# Altium schematic sheet PWM_CON_CPU.SchDoc: PWM Motor Controller - CPU
size A4; DocumentNumber: 2; Revision: 2; SheetNumber: 2; SheetTotal: 5; DrawnBy: T. Burns; Organization: N/A; ProjectName: PWM Motor Controller
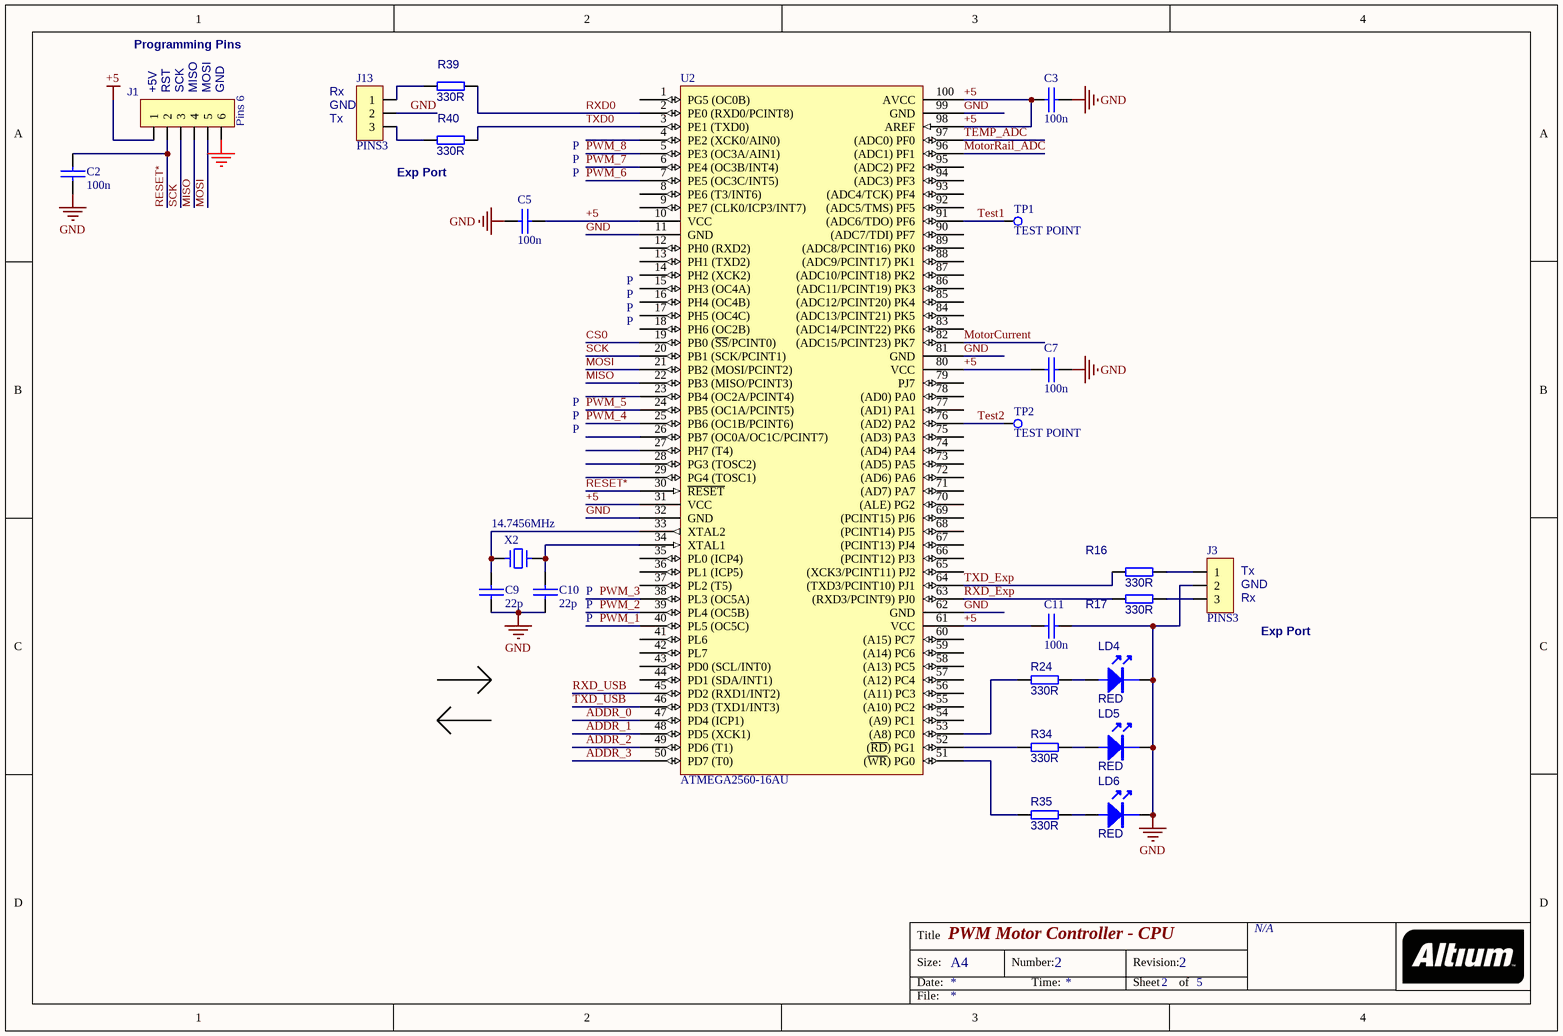
[diagram p0: PWM_CON_CPU.SchDoc]

## Parts
C2  100n  [0603]
C3  100n  [0603]
C5  100n  [0603]
C7  100n  [0603]
C9  22p  [0603]
C10  22p  [0603]
C11  100n  [0603]
J1  Pins 6  [SIP6]
J3  PINS3  [SIP3]
J13  PINS3  [SIP3]
LD4  RED  [0805DIODE]
LD5  RED  [0805DIODE]
LD6  RED  [0805DIODE]
R16  330R  [0603]
R17  330R  [0603]
R24  330R  [0603]
R34  330R  [0603]
R35  330R  [0603]
R39  330R  [0603]
R40  330R  [0603]
TP1  TEST POINT  [TEST POINT]
TP2  TEST POINT  [TEST POINT]
U2  ATMEGA2560-16AU  [100T1_N]
X2  14.7456MHz  [XTAL-V2]

## Nets
+5: C3.2 C5.1 C7.2 C11.2 J1.1 U2.10(VCC) U2.31(VCC) U2.61(VCC) U2.80(VCC) U2.98(AREF) U2.100(AVCC)
GND: C2.1 C3.1 C5.2 C7.1 C9.2 C10.2 C11.1 J1.6 J3.2 J13.2 LD4.K LD5.K LD6.K U2.11(GND) U2.32(GND) U2.62(GND) U2.81(GND) U2.99(GND)
ADDR_0: U2.47(PD4_(ICP1))
ADDR_1: U2.48(PD5_(XCK1))
ADDR_2: U2.49(PD6_(T1))
ADDR_3: U2.50(PD7_(T0))
CS0: U2.19(PB0_(~{SS}/PCINT0))
MISO: J1.4 U2.22(PB3_(MISO/PCINT3))
MOSI: J1.5 U2.21(PB2_(MOSI/PCINT2))
MotorCurrent: U2.82((ADC15/PCINT23)_PK7)
MotorRail_ADC: U2.96((ADC1)_PF1)
PWM_1: U2.40(PL5_(OC5C))
PWM_2: U2.39(PL4_(OC5B))
PWM_3: U2.38(PL3_(OC5A))
PWM_4: U2.25(PB6_(OC1B/PCINT6))
PWM_5: U2.24(PB5_(OC1A/PCINT5))
PWM_6: U2.7(PE5_(OC3C/INT5))
PWM_7: U2.6(PE4_(OC3B/INT4))
PWM_8: U2.5(PE3_(OC3A/AIN1))
RESET*: C2.2 J1.2 U2.30(~{RESET})
RXD0: R39.2 U2.2(PE0_(RXD0/PCINT8))
RXD_Exp: R17.1 U2.63((RXD3/PCINT9)_PJ0)
RXD_USB: U2.45(PD2_(RXD1/INT2))
SCK: J1.3 U2.20(PB1_(SCK/PCINT1))
TEMP_ADC: U2.97((ADC0)_PF0)
Test1: TP1.1 U2.91((ADC6/TDO)_PF6)
Test2: TP2.1 U2.76((AD2)_PA2)
TXD0: R40.2 U2.3(PE1_(TXD0))
TXD_Exp: R16.1 U2.64((TXD3/PCINT10)_PJ1)
TXD_USB: U2.46(PD3_(TXD1/INT3))
NetC9_1: C9.1 U2.33(XTAL2) X2.2
NetC10_1: C10.1 U2.34(XTAL1) X2.1
NetJ3_1: J3.1 R16.2
NetJ3_3: J3.3 R17.2
NetJ13_1: J13.1 R39.1
NetJ13_3: J13.3 R40.1
NetLD4_A: LD4.A R24.2
NetLD5_A: LD5.A R34.2
NetLD6_A: LD6.A R35.2
NetR24_1: R24.1 U2.53((A8)_PC0)
NetR34_1: R34.1 U2.52((~{RD})_PG1)
NetR35_1: R35.1 U2.51((~{WR})_PG0)

Not connected (* = marked no-connect by the designer): U2 1(PG5_(OC0B)) 4(PE2_(XCK0/AIN0)) 8(PE6_(T3/INT6)) 9(PE7_(CLK0/ICP3/INT7)) 12(PH0_(RXD2)) 13(PH1_(TXD2)) 14(PH2_(XCK2)) 15(PH3_(OC4A)) 16(PH4_(OC4B)) 17(PH5_(OC4C)) 18(PH6_(OC2B)) 23(PB4_(OC2A/PCINT4)) 26(PB7_(OC0A/OC1C/PCINT7)) 27(PH7_(T4)) 28(PG3_(TOSC2)) 29(PG4_(TOSC1)) 35(PL0_(ICP4)) 36(PL1_(ICP5)) 37(PL2_(T5)) 41(PL6) 42(PL7) 43(PD0_(SCL/INT0)) 44(PD1_(SDA/INT1)) 54((A9)_PC1) 55((A10)_PC2) 56((A11)_PC3) 57((A12)_PC4) 58((A13)_PC5) 59((A14)_PC6) 60((A15)_PC7) 65((XCK3/PCINT11)_PJ2) 66((PCINT12)_PJ3) 67((PCINT13)_PJ4) 68((PCINT14)_PJ5) 69((PCINT15)_PJ6) 70((ALE)_PG2) 71((AD7)_PA7) 72((AD6)_PA6) 73((AD5)_PA5) 74((AD4)_PA4) 75((AD3)_PA3) 77((AD1)_PA1) 78((AD0)_PA0) 79(PJ7) 83((ADC14/PCINT22)_PK6) 84((ADC13/PCINT21)_PK5) 85((ADC12/PCINT20)_PK4) 86((ADC11/PCINT19)_PK3) 87((ADC10/PCINT18)_PK2) 88((ADC9/PCINT17)_PK1) 89((ADC8/PCINT16)_PK0) 90((ADC7/TDI)_PF7) 92((ADC5/TMS)_PF5) 93((ADC4/TCK)_PF4) 94((ADC3)_PF3) 95((ADC2)_PF2)

## Notes on the sheet
- Programming Pins
- (near J1) +5V
- (near J1) RST
- (near J1) SCK
- (near J1) MISO
- (near J1) MOSI
- (near J1) GND
- (near J13) Rx
- (near J13) GND
- (near J13) Tx
- Exp Port
- P
- (near U2) P
- (near J3) Tx
- (near C10) P
- (near J3) Rx
- (near J3) GND
- (near J3) Exp Port
- Title
- Size:
- Date:
- A4
- Number:
- Time:
- Revision:
- Sheet
- of
- File:

## Library data of the parts
C2 C3 C5 C7 C11 = CAP: PartNo: R8835; Supplier: Altronics
C9 C10 = CAP: PartNo: R8736; Supplier: Altronics
J1 = CON6: PartNo: P5430; Supplier: Altronics
J3 J13 = CON3: PartNo: P5430; Supplier: Altronics
LD4-LD6 = LED: PartNo: Y1107; Supplier: Altronics
R16 R17 R24 R34 R35 R39 R40 = RES8: PartNo: R1560; Supplier: Element14
TP1 TP2 = TEST POINT: Probe compatible test point
U2 = ATMEGA2560(TQFP100): PartNo: 1288330; Supplier: Element14
X2 = CRYSTAL: PartNo: 1640874; Supplier: Element14